# EAGLE schematic KickBoard_Aquila (EAGLE 9.7.0)

## Sheet 1 of 6
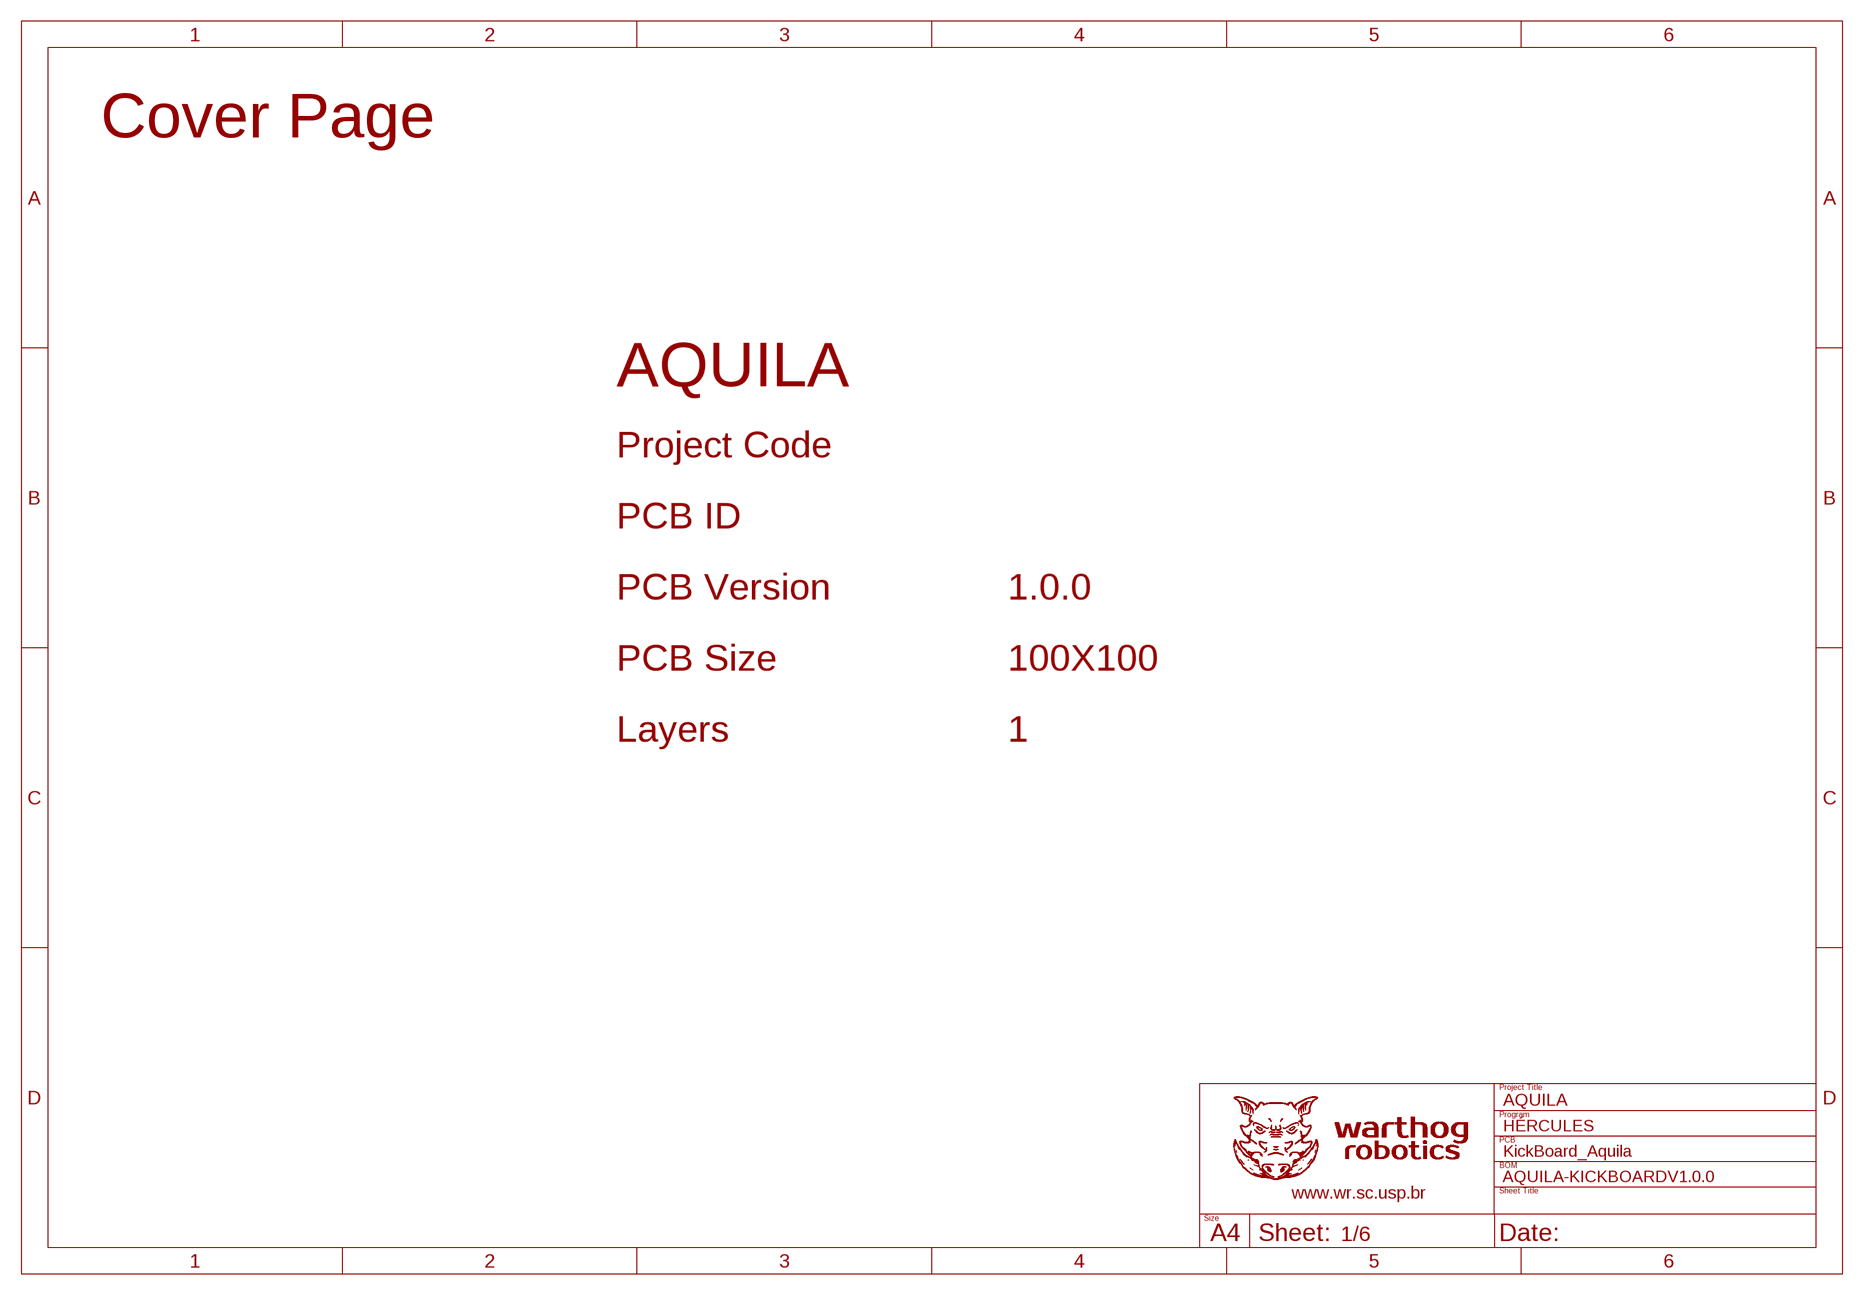
[diagram p0: schematic, sheet 1]
FRAME1 (WR-A4-COVER): BOM: AQUILA-KICKBOARDV1.0.0; DMNS: 100X100; L: 1; N: 1.0.0; PROG: HÉRCULES; PROJECT: AQUILA

## Sheet 2 of 6
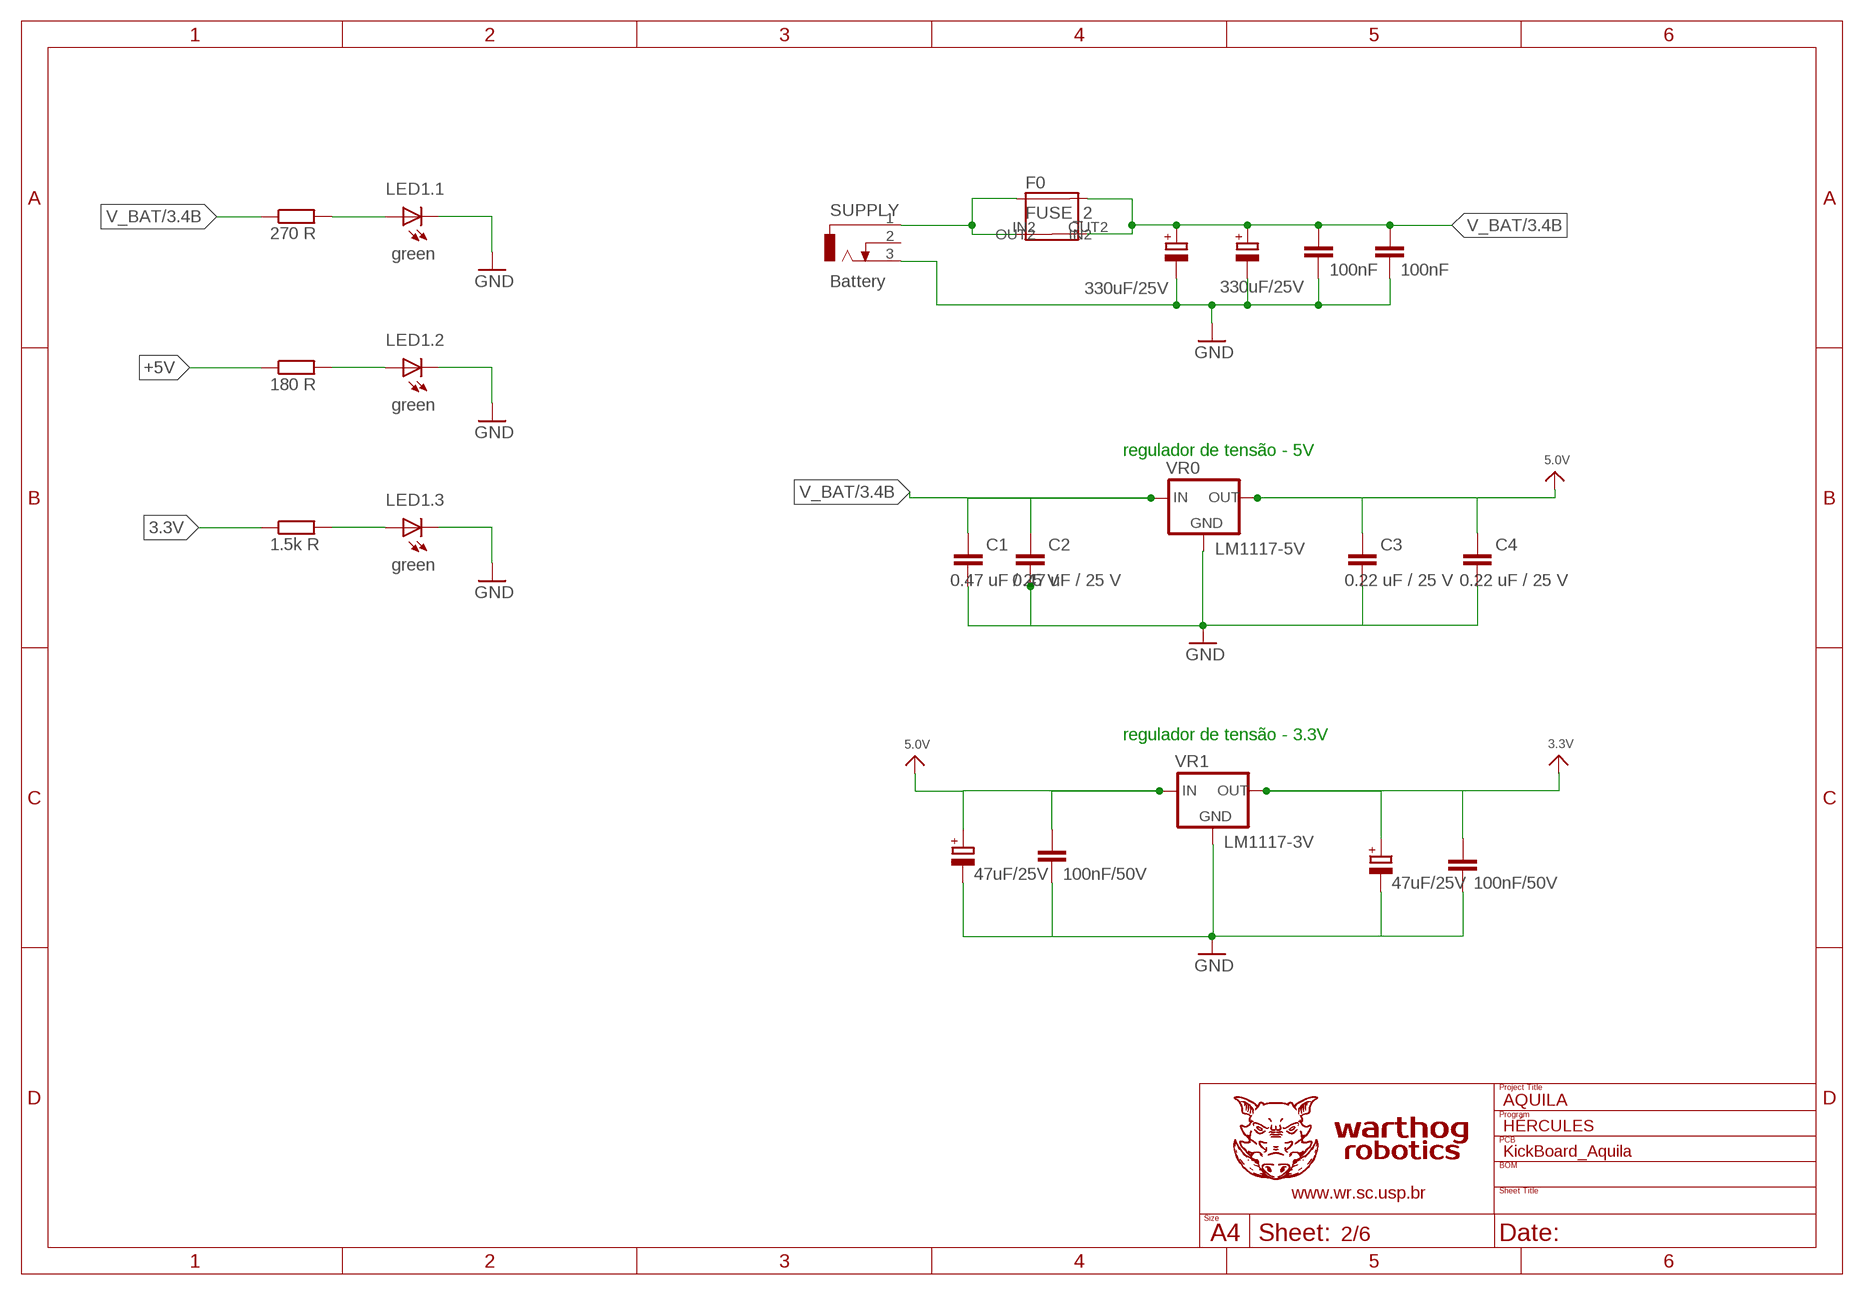
[diagram p1: schematic, sheet 2]
FRAME4 (WR-A4): PROG: HÉRCULES; PROJECT: AQUILA

### Parts
C1  0.47 uF / 25 V  C0805(M)  [C0805(M)]
C1.1  100nF/50V  C-EUC0805  [C0805]
C1.2  47uF/25V  CPOL-EUE2.5-6  [E2,5-6]
C1.12  47uF/25V  CPOL-EUE2.5-6  [E2,5-6]
C1.13  100nF/50V  C-EUC0805  [C0805]
C2  0.47 uF / 25 V  C0805(M)  [C0805(M)]
C3  0.22 uF / 25 V  C0805(M)  [C0805(M)]
C4  0.22 uF / 25 V  C0805(M)  [C0805(M)]
C4.5  330uF/25V  CPOL-EUE3.5-10  [E3,5-10]
C4.6  330uF/25V  CPOL-EUE3.5-10  [E3,5-10]
C4.7  100nF  C-EUC0805  [C0805]
C4.8  100nF  C-EUC0805  [C0805]
F0  FUSE_2  [SHKOG]
LED1.1  green  LEDSML0805  [SML0805]
LED1.2  green  LEDSML0805  [SML0805]
LED1.3  green  LEDSML0805  [SML0805]
R1.1  180 R  R-EU_R0805  [R0805]
R1.2  1.5k R  R-EU_R0805  [R0805]
R1.5  270 R  R-EU_R0805  [R0805]
SUPPLY  Battery  JACK-WARTHOG  [JACK-WARTHOG]
VR0  LM1117-5V  REG1117  [SOT230P700X170-4]
VR1  LM1117-3V  REG1117  [SOT230P700X170-4]

### Nets
3.3V: C1.1.1 C1.2.+ R1.2.1 VR1.2(OUT) VR1.4(OUT)
+5V: C1.12.+ C1.13.1 C3.1 C4.1 R1.1.1 VR0.2(OUT) VR0.4(OUT) VR1.3(IN)
GND: C1.1.2 C1.2 C1.2.- C1.12.- C1.13.2 C2.2 C3.2 C4.2 C4.5.- C4.6.- C4.7.2 C4.8.2 LED1.1.C LED1.2.C LED1.3.C SUPPLY.3 VR0.1(GND) VR1.1(GND) ; also sheet 3,4,5,6
N$1: LED1.1.A R1.5.2
N$2: LED1.2.A R1.1.2
N$3: LED1.3.A R1.2.2
N$8: F0.IN1 F0.IN2 SUPPLY.1
V_BAT: C1.1 C2.1 C4.5.+ C4.6.+ C4.7.1 C4.8.1 F0.OUT1 F0.OUT2 R1.5.1 VR0.3(IN) ; also sheet 3,4
Unconnected: SUPPLY.2

### Notes on the sheet
- regulador de tensão - 5V
- regulador de tensão - 3.3V

## Sheet 3 of 6
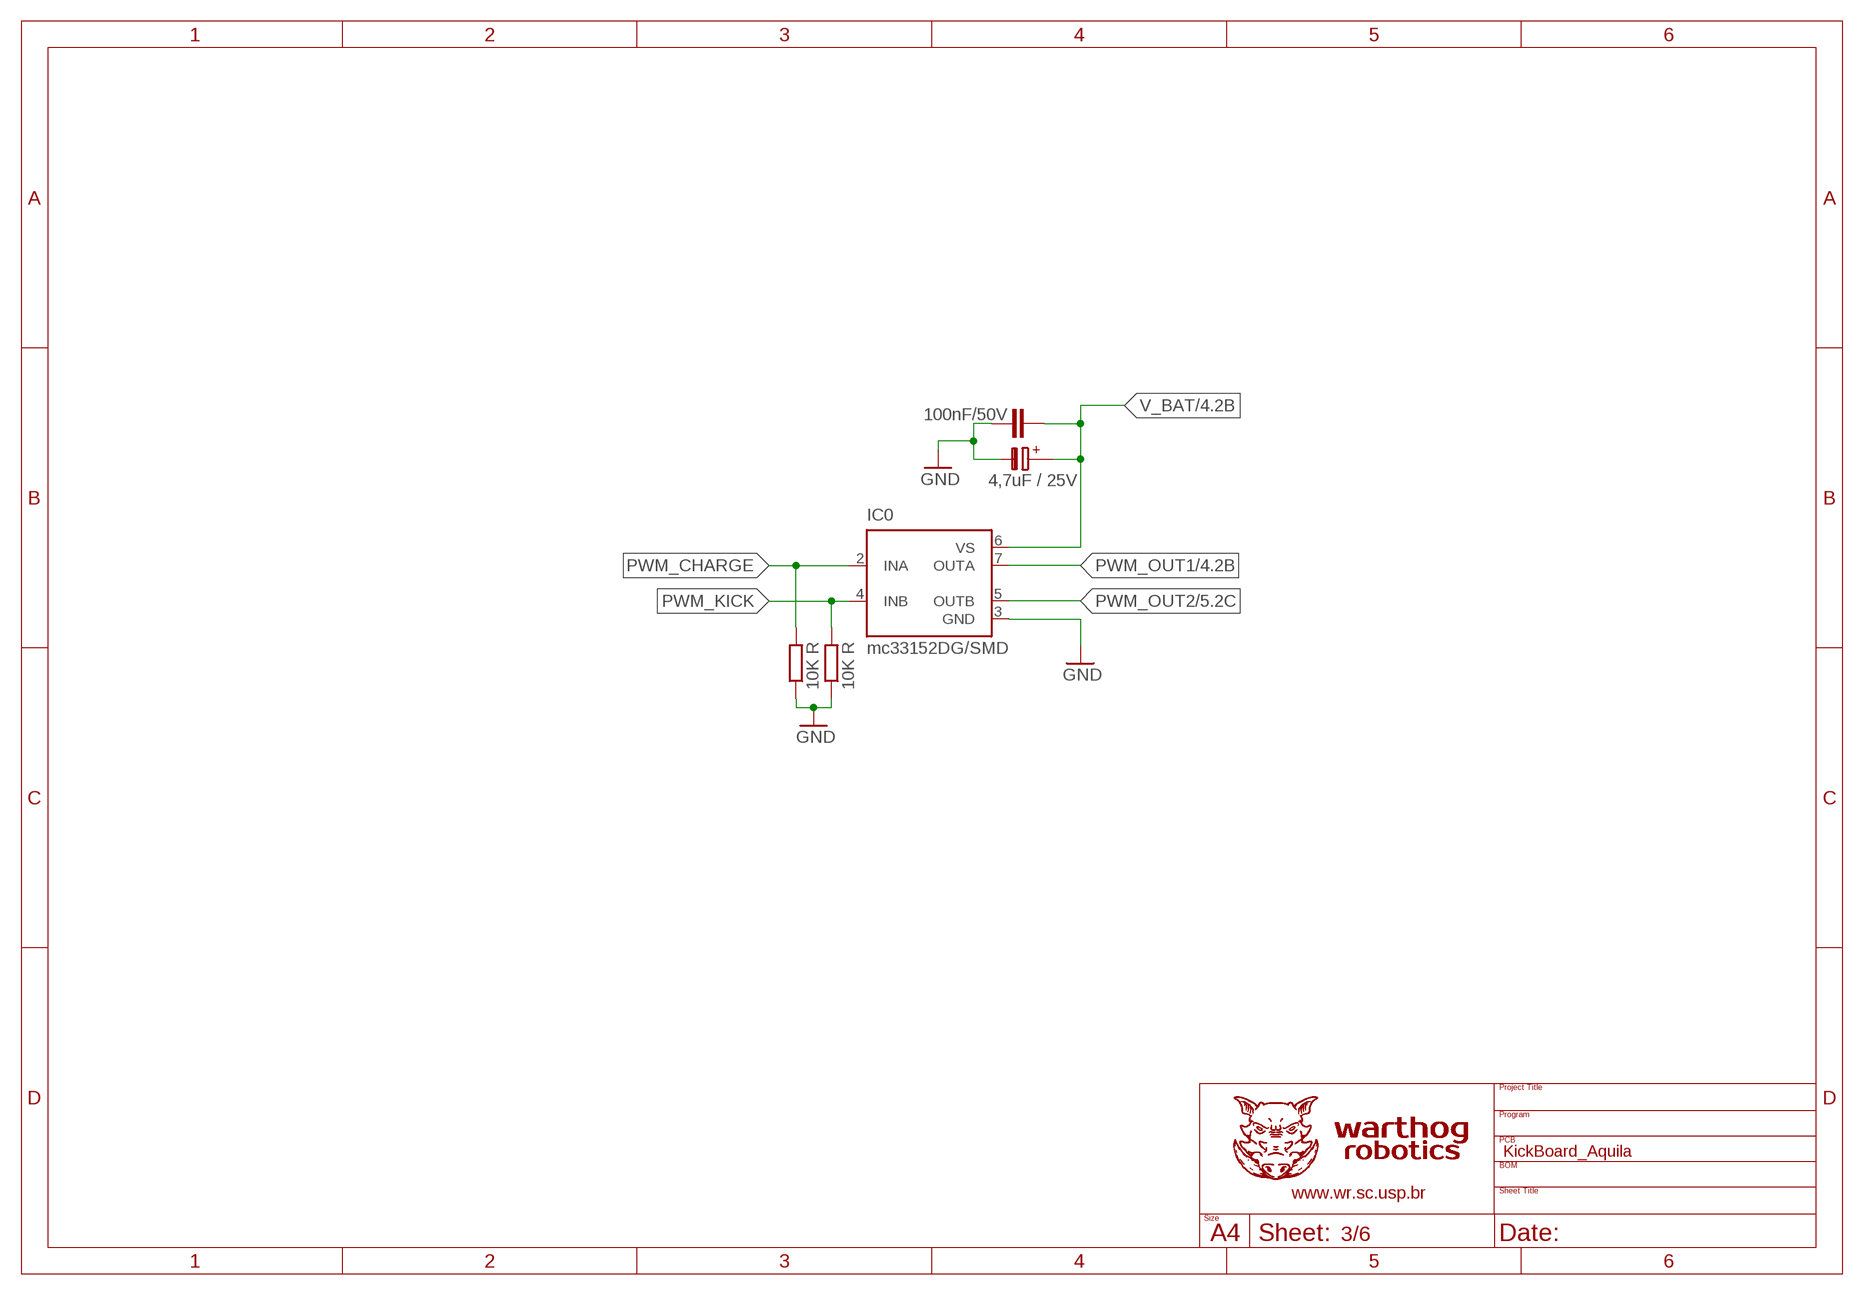
[diagram p2: schematic, sheet 3]

### Parts
C1.3  100nF/50V  C-EUC0805K  [C0805K]
IC0  mc33152DG/SMD  IR4427S  [SO08]
R1.3  10K R  R-EU_R0805  [R0805]
R1.4  10K R  R-EU_R0805  [R0805]
TAN1.2  4,7uF / 25V  C-PR-TT2,5-3  [TT2,5-3]

### Nets
GND: C1.3.1 IC0.3(GND) R1.3.1 R1.4.1 TAN1.2.- ; also sheet 2,4,5,6
PWM_CHARGE: IC0.2(INA) R1.3.2
PWM_KICK: IC0.4(INB) R1.4.2
PWM_OUT1: IC0.7(OUTA) ; also sheet 4
PWM_OUT2: IC0.5(OUTB) ; also sheet 5
V_BAT: C1.3.2 IC0.6(VS) TAN1.2.+ ; also sheet 2,4

## Sheet 4 of 6
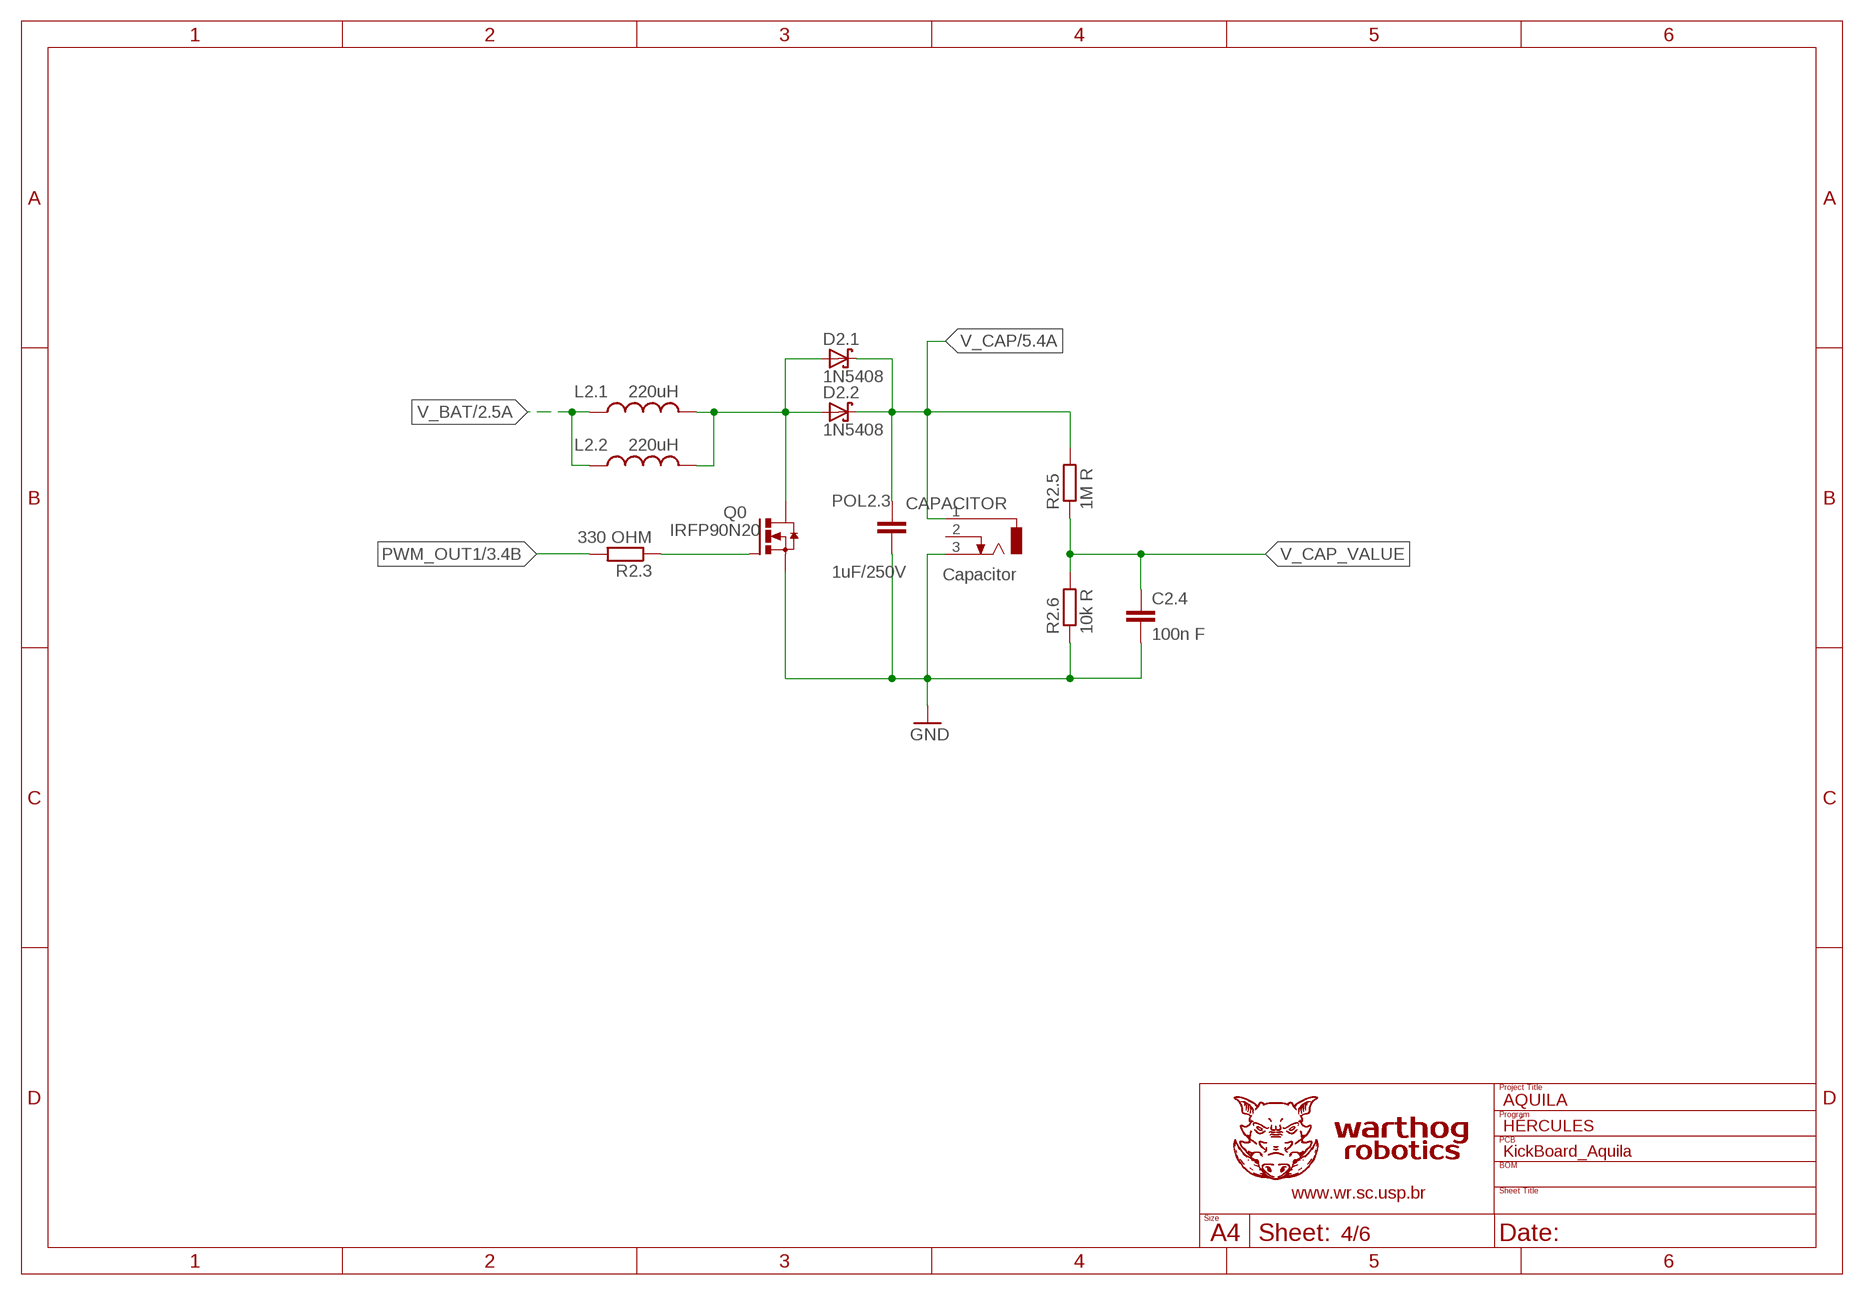
[diagram p3: schematic, sheet 4]
FRAME3 (WR-A4): PROG: HÉRCULES; PROJECT: AQUILA

### Parts
C2.4  100n F  C-EUC0805  [C0805]
CAPACITOR  Capacitor  JACK-WARTHOG  [JACK-WARTHOG]
D2.1  1N5408  BAT42  [DO35-10]
D2.2  1N5408  BAT42  [DO35-10]
L2.1  220uH  L-US0207/7  [0207/7@1]
L2.2  220uH  L-US0207/7  [0207/7@1]
POL2.3  1uF/250V  C-EU150-054X183  [C150-054X183]
Q0  IRFP90N20  IRFP240  [TO247BV]
R2.3  330 OHM  R-EU_R0805  [R0805]
R2.5  1M R  R-EU_R0805  [R0805]
R2.6  10k R  R-EU_R0805  [R0805]

### Nets
GND: C2.4.2 CAPACITOR.3 POL2.3.2 Q0.S R2.6.1 ; also sheet 2,3,5,6
I/D [Power]: D2.1.A D2.2.A L2.1.2 L2.2.2 Q0.D
N$4: Q0.G R2.3.1
PWM_OUT1: R2.3.2 ; also sheet 3
V_BAT: L2.1.1 L2.2.1 ; also sheet 2,3
V_CAP [Power]: CAPACITOR.1 D2.1.C D2.2.C POL2.3.1 R2.5.2 ; also sheet 5
V_CAP_VALUE: C2.4.1 R2.5.1 R2.6.2
Unconnected: CAPACITOR.2

## Sheet 5 of 6
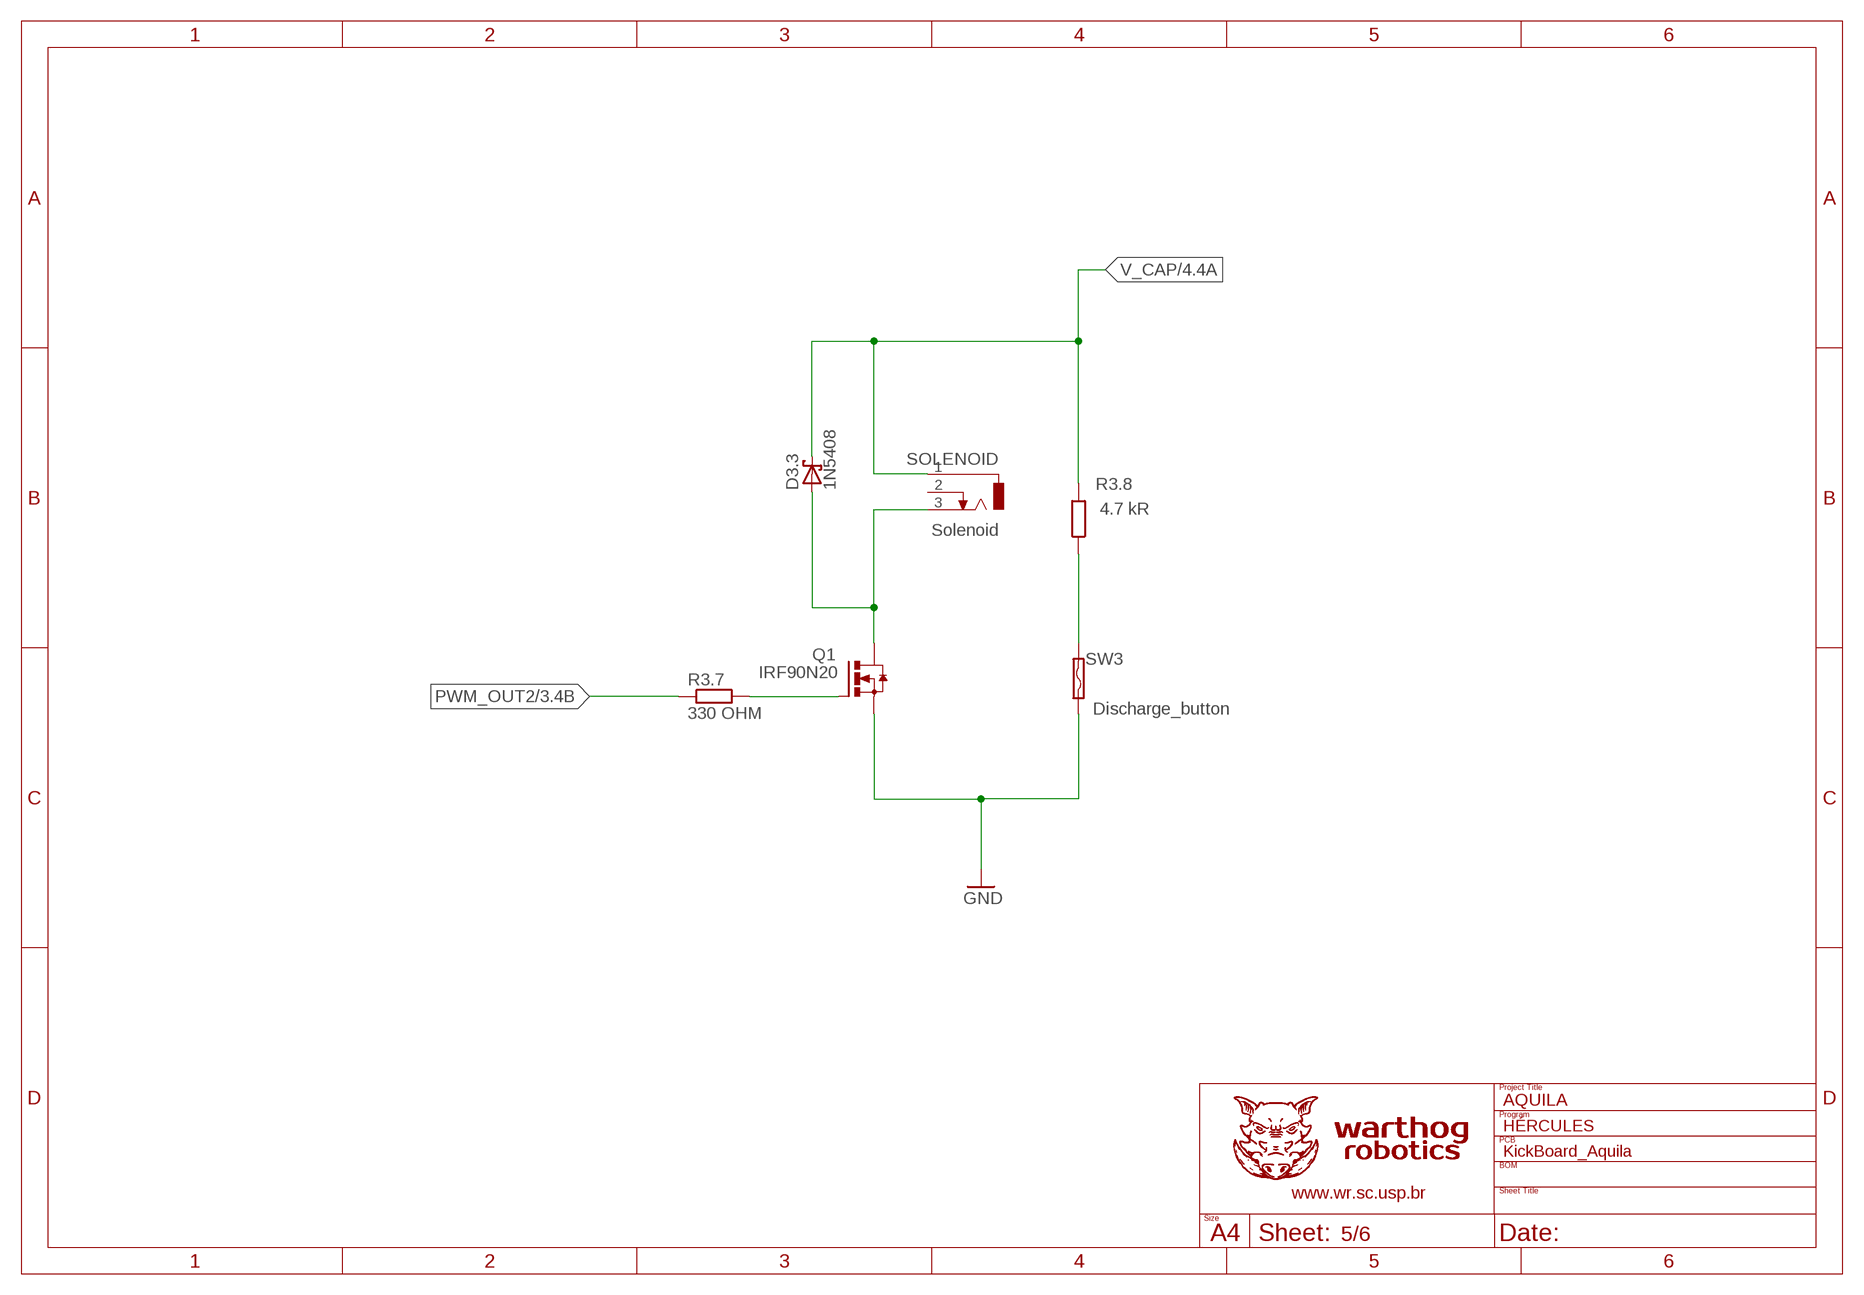
[diagram p4: schematic, sheet 5]
FRAME5 (WR-A4): PROG: HÉRCULES; PROJECT: AQUILA

### Parts
D3.3  1N5408  BAT42  [DO35-10]
Q1  IRF90N20  IRFP240  [TO247BV]
R3.7  330 OHM  R-EU_R0805  [R0805]
R3.8  4.7 kR  R-EU_0817/22  [P0817/22]
SOLENOID  Solenoid  JACK-WARTHOG  [JACK-WARTHOG]
SW3  Discharge_button  SMD050F  [SMD050F]

### Nets
GND: Q1.S SW3.1 ; also sheet 2,3,4,6
N$5 [Power]: R3.8.1 SW3.2
N$10 [Power]: Q1.G R3.7.2
N$14 [Power]: D3.3.A Q1.D SOLENOID.3
PWM_OUT2: R3.7.1 ; also sheet 3
V_CAP [Power]: D3.3.C R3.8.2 SOLENOID.1 ; also sheet 4
Unconnected: SOLENOID.2

## Sheet 6 of 6
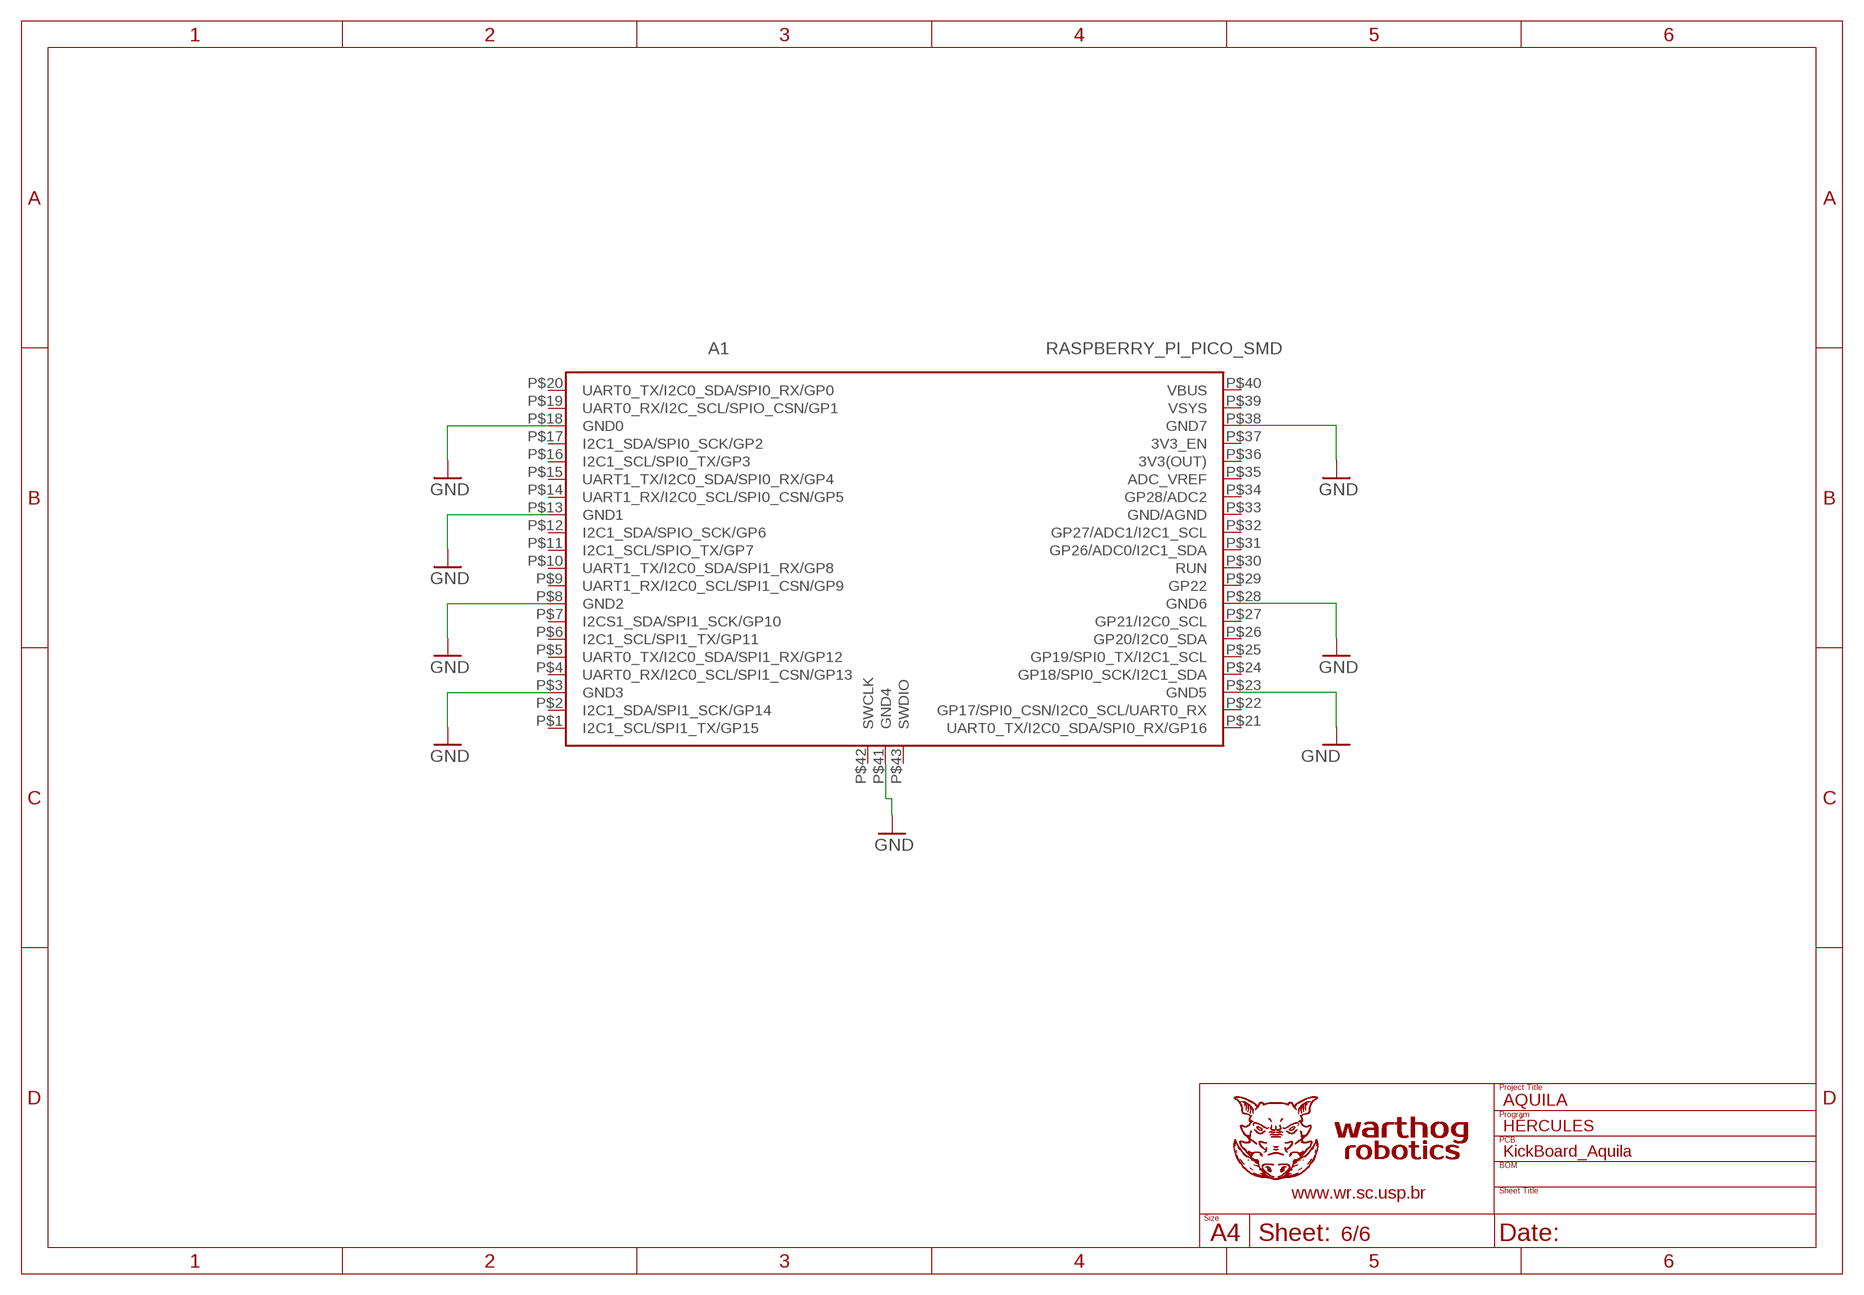
[diagram p5: schematic, sheet 6]
FRAME6 (WR-A4): PROG: HÉRCULES; PROJECT: AQUILA

### Parts
A1  RASPBERRY_PI_PICO_SMD  [RASPBERRY_PI_PICO_SMD]

### Nets
GND: A1.P$3(GND3) A1.P$8(GND2) A1.P$13(GND1) A1.P$18(GND0) A1.P$23(GND5) A1.P$28(GND6) A1.P$38(GND7) A1.P$41(GND4) ; also sheet 2,3,4,5
Unconnected: A1.P$1(I2C1_SCL/SPI1_TX/GP15) A1.P$2(I2C1_SDA/SPI1_SCK/GP14) A1.P$4(UART0_RX/I2C0_SCL/SPI1_CSN/GP13) A1.P$5(UART0_TX/I2C0_SDA/SPI1_RX/GP12) A1.P$6(I2C1_SCL/SPI1_TX/GP11) A1.P$7(I2CS1_SDA/SPI1_SCK/GP10) A1.P$9(UART1_RX/I2C0_SCL/SPI1_CSN/GP9) A1.P$10(UART1_TX/I2C0_SDA/SPI1_RX/GP8) A1.P$11(I2C1_SCL/SPIO_TX/GP7) A1.P$12(I2C1_SDA/SPIO_SCK/GP6) A1.P$14(UART1_RX/I2C0_SCL/SPI0_CSN/GP5) A1.P$15(UART1_TX/I2C0_SDA/SPI0_RX/GP4) A1.P$16(I2C1_SCL/SPI0_TX/GP3) A1.P$17(I2C1_SDA/SPI0_SCK/GP2) A1.P$19(UART0_RX/I2C_SCL/SPIO_CSN/GP1) A1.P$20(UART0_TX/I2C0_SDA/SPI0_RX/GP0) A1.P$21(UART0_TX/I2C0_SDA/SPI0_RX/GP16) A1.P$22(GP17/SPI0_CSN/I2C0_SCL/UART0_RX) A1.P$24(GP18/SPI0_SCK/I2C1_SDA) A1.P$25(GP19/SPI0_TX/I2C1_SCL) A1.P$26(GP20/I2C0_SDA) A1.P$27(GP21/I2C0_SCL) A1.P$29(GP22) A1.P$30(RUN) A1.P$31(GP26/ADC0/I2C1_SDA) A1.P$32(GP27/ADC1/I2C1_SCL) A1.P$33(GND/AGND) A1.P$34(GP28/ADC2) A1.P$35(ADC_VREF) A1.P$36(3V3(OUT)) A1.P$37(3V3_EN) A1.P$39(VSYS) A1.P$40(VBUS) A1.P$42(SWCLK) A1.P$43(SWDIO)

## Library data of the parts
A1 = WarthogRobotics-Modules:RASPBERRY_PI_PICO_SMD
C1-C4 = WarthogRobotics-RLC:C
C1.1 C1.13 = rcl:C-EU: CAPACITOR, European symbol
C1.2 C1.12 C4.5 C4.6 = rcl:CPOL-EU: POLARIZED CAPACITOR, European symbol; SPICEPREFIX: C
C1.3 = resistor:C-EU: CAPACITOR, European symbol
C2.4 C4.7 C4.8 POL2.3 = rcl:C-EU: CAPACITOR, European symbol; SPICEPREFIX: C
CAPACITOR SOLENOID SUPPLY = JACK-WARTHOG:JACK-WARTHOG
D2.1 D2.2 D3.3 = diode:BAT42: DIODE barrier diode
F0 = fuse.1:FUSE_2
IC0 = ir:IR4427: DUAL LOW SIDE DRIVER Source: ID4426.pdf; MF: INTERNATIONAL RECTIFIER(IR); MPN: IR4427STRPBF; OC_FARNELL: 8639094; OC_NEWARK: 63J7933
L2.1 L2.2 = rcl:L-US: INDUCTOR, American symbol
LED1.1-LED1.3 = led:LED: LED OSRAM: - CHIPLED LG R971, LG N971, LY N971, LG Q971, LY Q971, LO R971, LY R971 LH N974, LH R974 LS Q976, LO Q976, LY Q976 LO Q996 - Hyper CHIPLED LW Q18S LB Q993, LB Q99A, LB R99A - SideLED LS A670, LO A670, LY A670, LG A670, LP A670 LB A673, LV A673, LT A673, LW A673 LH A674 LY A675 LS A676, LA A676, LO A676, LY A676, LW A676 LS A679, LY A679, LG A679 - Hyper Micro SIDELED® LS Y876, LA Y876, LO Y876, LY Y876 LT Y87S - SmartLED LW L88C, LW L88S LB L89C, LB L89S, LG L890 LS L89K, LO L89K, LY L89K LS L896, LA L896, LO L896, LY L896 - TOPLED LS T670, LO T670, LY T670, LG T670, LP T670 LSG T670, LSP T670, LSY T670, LOP T670, LYG T670 LG T671, LOG T671, LSG T671 LB T673, LV T673, LT T673, LW T673 LH T674 LS T676, LA T676, LO T676, LY T676, LB T676, LH T676, LSB T676, LW T676 LB T67C, LV T67C, LT T67C, LS T67K, LO T67K, LY T67K, LW E67C LS E67B, LA E67B, LO E67B, LY E67B, LB E67C, LV E67C, LT E67C LW T67C LS T679, LY T679, LG T679 LS T770, LO T770, LY T770, LG T770, LP T770 LB T773, LV T773, LT T773, LW T773 LH T774 LS E675, LA E675, LY E675, LS T675 LS T776, LA T776, LO T776, LY T776, LB T776 LHGB T686 LT T68C, LB T68C - Hyper Mini TOPLED® LB M676 - Mini TOPLED Santana® LG M470 LS M47K, LO M47K, LY M47K Source: http://www.osram.convergy.de LUXEON: - LUMILED® LXK2-PW12-R00, LXK2-PW12-S00, LXK2-PW14-U00, LXK2-PW14-V00 LXK2-PM12-R00, LXK2-PM12-S00, LXK2-PM14-U00 LXK2-PE12-Q00, LXK2-PE12-R00, LXK2-PE12-S00, LXK2-PE14-T00, LXK2-PE14-U00 LXK2-PB12-K00, LXK2-PB12-L00, LXK2-PB12-M00, LXK2-PB14-N00, LXK2-PB14-P00, LXK2-PB14-Q00 LXK2-PR12-L00, LXK2-PR12-M00, LXK2-PR14-Q00, LXK2-PR14-R00 LXK2-PD12-Q00, LXK2-PD12-R00, LXK2-PD12-S00 LXK2-PH12-R00, LXK2-PH12-S00 LXK2-PL12-P00, LXK2-PL12-Q00, LXK2-PL12-R00 Source: www.luxeon.com KINGBRIGHT: KA-3528ASYC Source: www.kingbright.com
Q0 Q1 = transistor-power:IRFP240: HEXFET Power MosFet Source: http://www.irf.com/
R1.1-R1.5 = rcl-2:R-EU_: RESISTOR, European symbol
R2.3 R2.5 R2.6 R3.8 = rcl:R-EU_: RESISTOR, European symbol
R3.7 = resistor:R-EU_: RESISTOR, European symbol
SW3 = switch-raychem:SMD*F: PolySwitch (TM) Resettable Device Source: Data sheet <http://www.farnell.com/datasheets/13482.pdf>
TAN1.2 = cap-pan40:C-PR: POLARIZED ELECTROLYTIC/TANTALUM
VR0 VR1 = WarthogRobotics-IC-Power:REG1117

## Net classes
1 Power: width 0.61 mm, clearance 0.457 mm